# EAGLE schematic signal_processing_module (EAGLE 9.5.2)
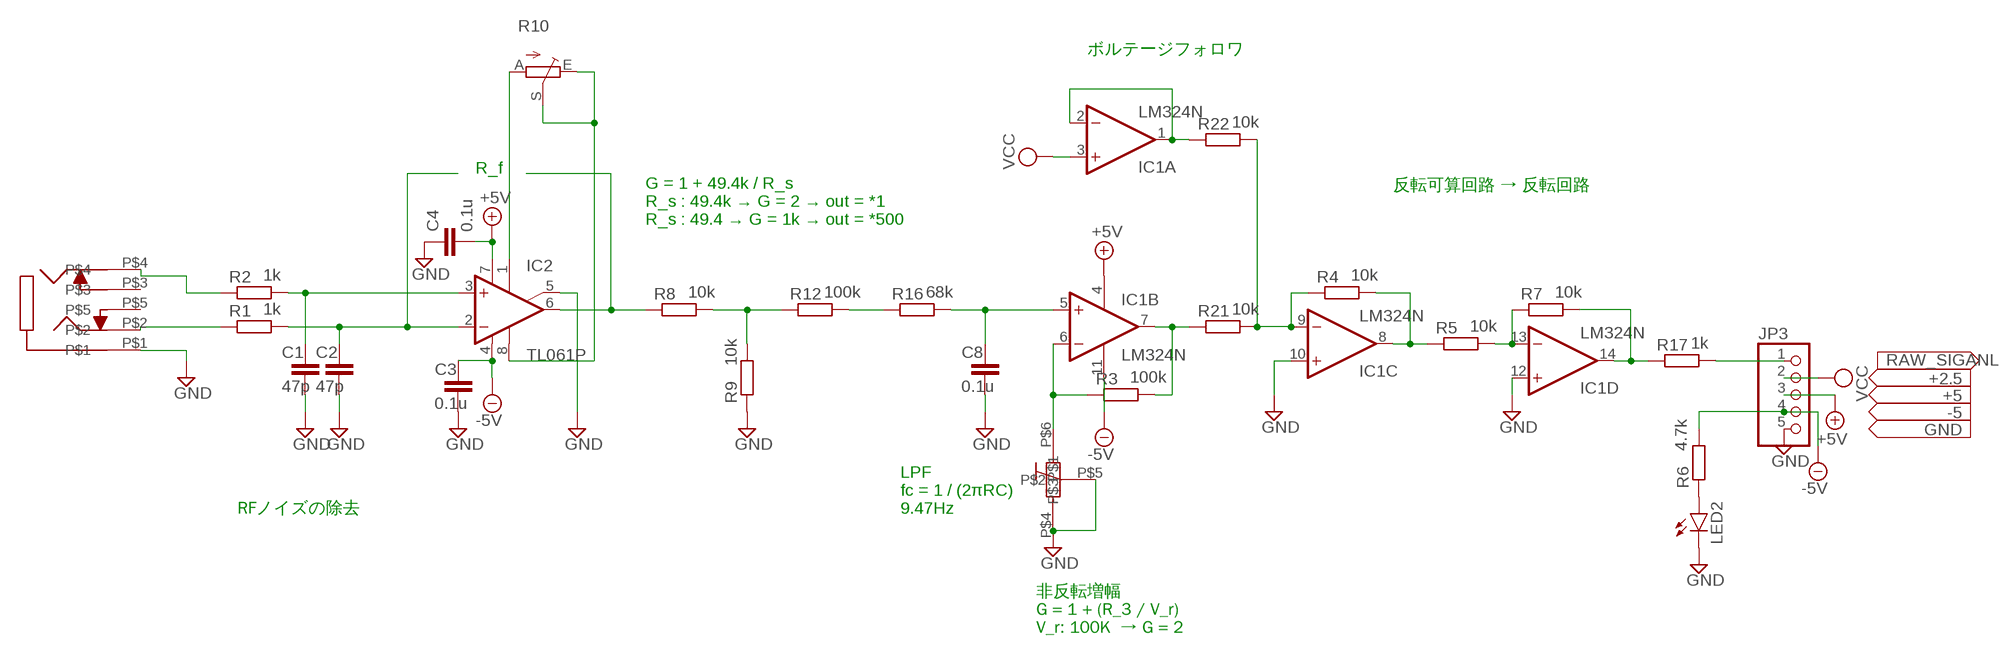
[diagram p0: schematic, sheet 1]

## Parts
C1  47p  C-EU025-024X044  [C025-024X044]
C2  47p  C-EU025-024X044  [C025-024X044]
C3  0.1u  C-EU025-024X044  [C025-024X044]
C4  0.1u  C-EU025-024X044  [C025-024X044]
C8  0.1u  C-EU025-024X044  [C025-024X044]
IC1  LM324N  [DIL14]
IC2  TL061P  [DIL08]
JP3  PINHD-1X5  [1X05]
LED2  LED3MM  [LED3MM]
R1  1k  R-EU_0204/7  [0204/7]
R2  1k  R-EU_0204/7  [0204/7]
R3  100k  R-EU_0204/7  [0204/7]
R4  10k  R-EU_0204/7  [0204/7]
R5  10k  R-EU_0204/7  [0204/7]
R6  4.7k  R-EU_0204/7  [0204/7]
R7  10k  R-EU_0204/7  [0204/7]
R8  10k  R-EU_0204/7  [0204/7]
R9  10k  R-EU_0204/7  [0204/7]
R10  TRIM_EU-RS3  [RS3]
R12  100k  R-EU_0204/7  [0204/7]
R16  68k  R-EU_0204/7  [0204/7]
R17  1k  R-EU_0204/7  [0204/7]
R21  10k  R-EU_0204/7  [0204/7]
R22  10k  R-EU_0204/7  [0204/7]
U$2  MJ-354W-SG  [MJ-354W-SG]
U$3  VR_2CH  [2CH_VR]

## Nets
+5V: C4.2 IC1.4(P:V+) IC2.7(V+) JP3.3
-5V: C3.1 IC1.11(P:V-) IC2.4(V-) JP3.4 R6.2
GND: C1.2 C2.2 C3.2 C4.1 C8.2 IC1.10(C:+IN) IC1.12(D:+IN) IC2.5(ON2) JP3.5 LED2.K(C) R9.1 U$2.P$1 U$3.P$4 U$3.P$5
N$1: R1.1 U$2.P$2
N$2: R2.1 U$2.P$4
N$3: C1.1 IC2.3(+IN) R2.2
N$4: C2.1 IC2.2(-IN) R1.2
N$5: IC2.8(OPT) R10.E R10.S
N$6: IC2.6(OUT) R8.1
N$7: IC2.1(ON1) R10.A
N$8: R12.2 R16.1
N$9: IC1.13(D:-IN) R5.2 R7.1
N$10: JP3.1 R17.2
N$11: LED2.A R6.1
N$12: IC1.6(B:-IN) R3.1 U$3.P$6
N$13: IC1.8(C:OUT) R4.2 R5.1
N$14: IC1.14(D:OUT) R7.2 R17.1
N$15: C8.1 IC1.5(B:+IN) R16.2
N$16: R8.2 R9.2 R12.1
N$18: IC1.1(A:OUT) IC1.2(A:-IN) R22.1
N$21: IC1.9(C:-IN) R4.1 R21.2 R22.2
RAW_SIGNAL: IC1.7(B:OUT) R3.2 R21.1
VCC: IC1.3(A:+IN) JP3.2
Unconnected: U$2.P$3 U$2.P$5 U$3.P$1 U$3.P$2 U$3.P$3

## Notes on the sheet
- ボルテージフォロワ
- R_f
- 反転可算回路 → 反転回路
- G = 1 + 49.4k / R_s
  R_s : 49.4k → G = 2 → out = *1
  R_s : 49.4 → G = 1k → out = *500
- RFノイズの除去
- LPF
  fc = 1 / (2πRC)
  9.47Hz
- 非反転増幅
  G = 1 + (R_3 / V_r)
  V_r: 100K  → G = 2

## Library data of the parts
C1-C4 C8 = rcl:C-EU: CAPACITOR, European symbol; SPICEPREFIX: C
IC1 = linear:LM324: OP AMP
IC2 = linear:TL061: OP AMP
JP3 = pinhead:PINHD-1X5: PIN HEADER
LED2 = led:LED: LED OSRAM: - CHIPLED LG R971, LG N971, LY N971, LG Q971, LY Q971, LO R971, LY R971 LH N974, LH R974 LS Q976, LO Q976, LY Q976 LO Q996 - Hyper CHIPLED LW Q18S LB Q993, LB Q99A, LB R99A - SideLED LS A670, LO A670, LY A670, LG A670, LP A670 LB A673, LV A673, LT A673, LW A673 LH A674 LY A675 LS A676, LA A676, LO A676, LY A676, LW A676 LS A679, LY A679, LG A679 - Hyper Micro SIDELED® LS Y876, LA Y876, LO Y876, LY Y876 LT Y87S - SmartLED LW L88C, LW L88S LB L89C, LB L89S, LG L890 LS L89K, LO L89K, LY L89K LS L896, LA L896, LO L896, LY L896 - TOPLED LS T670, LO T670, LY T670, LG T670, LP T670 LSG T670, LSP T670, LSY T670, LOP T670, LYG T670 LG T671, LOG T671, LSG T671 LB T673, LV T673, LT T673, LW T673 LH T674 LS T676, LA T676, LO T676, LY T676, LB T676, LH T676, LSB T676, LW T676 LB T67C, LV T67C, LT T67C, LS T67K, LO T67K, LY T67K, LW E67C LS E67B, LA E67B, LO E67B, LY E67B, LB E67C, LV E67C, LT E67C LW T67C LS T679, LY T679, LG T679 LS T770, LO T770, LY T770, LG T770, LP T770 LB T773, LV T773, LT T773, LW T773 LH T774 LS E675, LA E675, LY E675, LS T675 LS T776, LA T776, LO T776, LY T776, LB T776 LHGB T686 LT T68C, LB T68C - Hyper Mini TOPLED® LB M676 - Mini TOPLED Santana® LG M470 LS M47K, LO M47K, LY M47K Source: http://www.osram.convergy.de LUXEON: - LUMILED® LXK2-PW12-R00, LXK2-PW12-S00, LXK2-PW14-U00, LXK2-PW14-V00 LXK2-PM12-R00, LXK2-PM12-S00, LXK2-PM14-U00 LXK2-PE12-Q00, LXK2-PE12-R00, LXK2-PE12-S00, LXK2-PE14-T00, LXK2-PE14-U00 LXK2-PB12-K00, LXK2-PB12-L00, LXK2-PB12-M00, LXK2-PB14-N00, LXK2-PB14-P00, LXK2-PB14-Q00 LXK2-PR12-L00, LXK2-PR12-M00, LXK2-PR14-Q00, LXK2-PR14-R00 LXK2-PD12-Q00, LXK2-PD12-R00, LXK2-PD12-S00 LXK2-PH12-R00, LXK2-PH12-S00 LXK2-PL12-P00, LXK2-PL12-Q00, LXK2-PL12-R00 Source: www.luxeon.com KINGBRIGHT: KA-3528ASYC Source: www.kingbright.com
R1-R9 R12 R16 R17 R21 R22 = rcl:R-EU_: RESISTOR, European symbol; SPICEPREFIX: R
R10 = pot:TRIM_EU-: POTENTIOMETER
U$2 = myparts:MJ-354W-SG
U$3 = myparts:VR_2CH

## Net classes
0 default: width 1.27 mm, clearance 0.381 mm